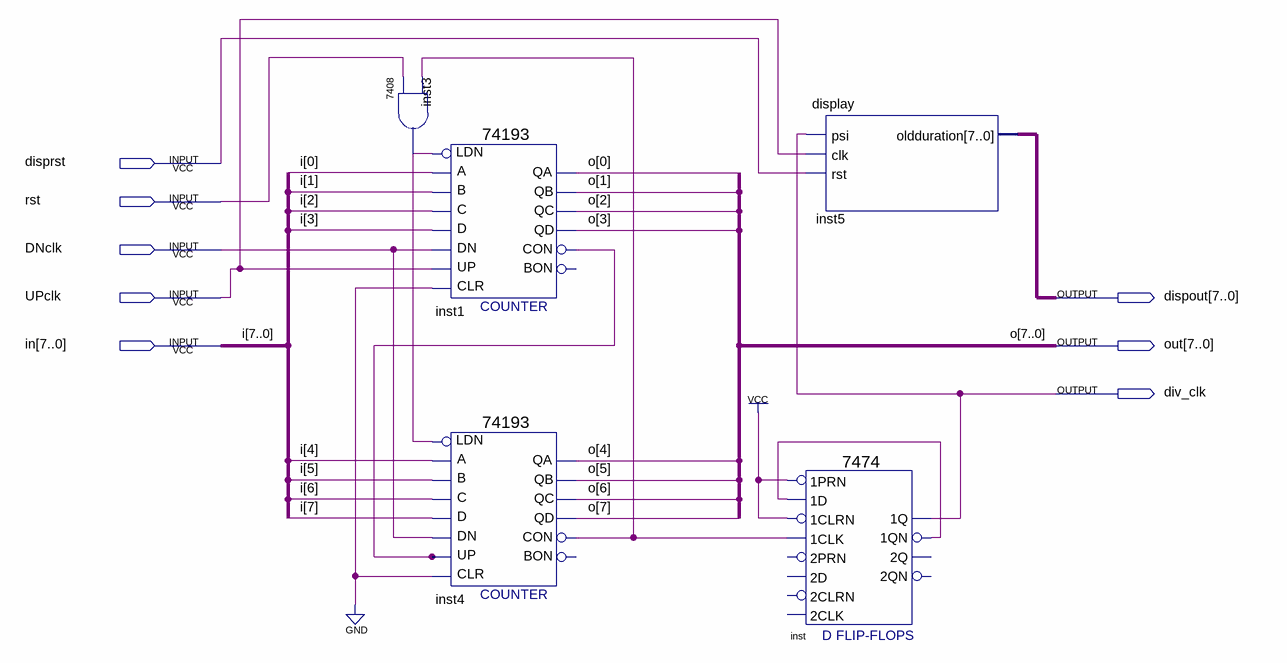
[diagram p0: schematic sheet]
// Quartus schematic frequencyDivider.bdf as structural Verilog: 5 symbols, 8 pins
module frequencyDivider (
  input  disprst,
  input  rst,
  input  DNclk,
  input  UPclk,
  input  [7:0] in,
  output [7:0] dispout,
  output [7:0] out,
  output div_clk
);

  wire inst1_con, inst3_1, inst4_con, inst_1qn;

  \7408  inst3 (.\3 (inst4_con), .\2 (rst), .\1 (inst3_1));
  \74193  inst1 (
    .D(in[3]), .C(in[2]), .B(in[1]), .A(in[0]), .CLR(1'b0), .UP(UPclk), .DN(DNclk), .LDN(inst3_1),
    .QB(out[1]), .QA(out[0]), .CON(inst1_con), .QD(out[3]), .QC(out[2]));  // open: BON
  \74193  inst4 (
    .D(in[7]), .C(in[6]), .B(in[5]), .A(in[4]), .CLR(1'b0), .UP(inst1_con), .DN(DNclk), .LDN(inst3_1),
    .QB(out[5]), .QA(out[4]), .CON(inst4_con), .QD(out[7]), .QC(out[6]));  // open: BON
  \7474  inst (
    .\1CLK (inst4_con), .\1D (inst_1qn), .\1PRN (1'b1), .\1CLRN (1'b1), .\1QN (inst_1qn), .\1Q (div_clk));  // open: 2D, 2PRN, 2CLK, 2CLRN, 2Q, 2QN
  display inst5 (.psi(div_clk), .clk(UPclk), .rst(disprst), .oldduration(dispout));

  // Other names for the same wires on the sheet: i[7:0] = in; o[7:0] = out
endmodule
